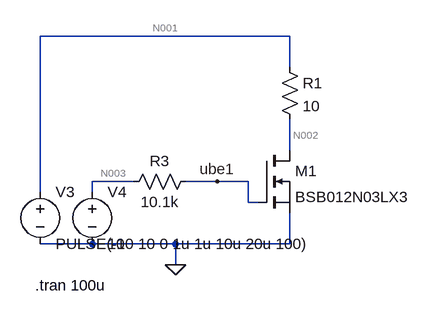
[diagram p0: schematic Inversbetrieb.asc]
Inversbetrieb.asc, the LTspice schematic file:
Version 4
SHEET 1 880 680
WIRE -3808 -1472 -4192 -1472
WIRE -3808 -1424 -3808 -1472
WIRE -3808 -1296 -3808 -1344
WIRE -4048 -1248 -4112 -1248
WIRE -3920 -1248 -3968 -1248
WIRE -3872 -1248 -3920 -1248
WIRE -4192 -1232 -4192 -1472
WIRE -4112 -1232 -4112 -1248
WIRE -3872 -1216 -3872 -1248
WIRE -3856 -1216 -3872 -1216
WIRE -4112 -1152 -4192 -1152
WIRE -3984 -1152 -4112 -1152
WIRE -3808 -1152 -3808 -1200
WIRE -3808 -1152 -3984 -1152
WIRE -3984 -1120 -3984 -1152
FLAG -3984 -1120 0
FLAG -3920 -1248 ube1
SYMBOL voltage -4192 -1248 R0
WINDOW 123 0 0 Left 2
WINDOW 39 0 0 Left 2
SYMATTR InstName V3
SYMATTR Value PULSE(-10 10 0 1u 1u 10u 20u 100)
SYMBOL voltage -4112 -1248 R0
WINDOW 123 0 0 Left 2
WINDOW 39 0 0 Left 2
SYMATTR InstName V4
SYMATTR Value 10
SYMBOL res -3952 -1264 R90
WINDOW 0 0 56 VBottom 2
WINDOW 3 32 56 VTop 2
SYMATTR InstName R3
SYMATTR Value 10.1k
SYMBOL res -3824 -1440 R0
SYMATTR InstName R1
SYMATTR Value 10
SYMBOL nmos -3856 -1296 R0
SYMATTR InstName M1
SYMATTR Value BSB012N03LX3
TEXT -4200 -1088 Left 2 !.tran 100u

The netlist it stands for:
* Inversbetrieb.asc
V3 N001 0 PULSE(-10 10 0 1u 1u 10u 20u 100)
V4 N003 0 10
R3 ube1 N003 10.1k
R1 N001 N002 10
M1 N002 ube1 0 0 BSB012N03LX3
.model NMOS NMOS
.model PMOS PMOS
.lib standard.mos
.tran 100u
.backanno
.end

* Results of the author's LTspice run, read from the files saved beside the schematic
* Operating Point, zero values left out:
*   V(n001) = -10 V
*   V(n003) = 10 V
*   V(ube1) = 10 V
*   V(n002) = -922.5 µV
*   Id(M1) = -999.9 mA
*   Is(M1) = 999.9 mA
*   I(R1) = -999.9 mA
*   I(V3) = 999.9 mA
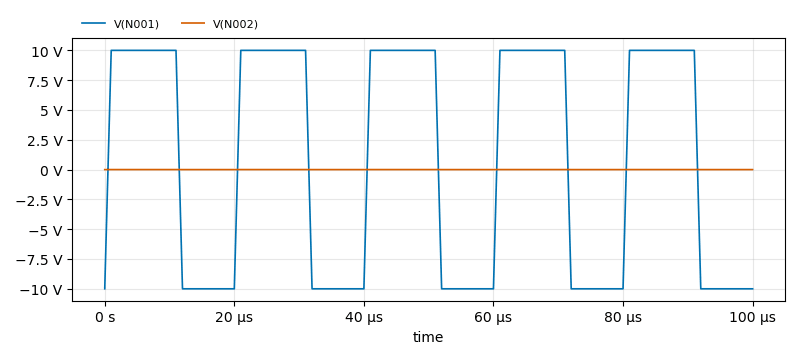
[diagram p1: Transient Analysis of Inversbetrieb.asc, plotted from the saved traces]
* Transient Analysis, 1 run:
*   V(N001): min -10 V, max 10 V, average 1 V, rms 10 V, last -10 V
*   V(N002): min -922.5 µV, max 922.5 µV, average 92.25 µV, rms 922.5 µV, last -922.5 µV